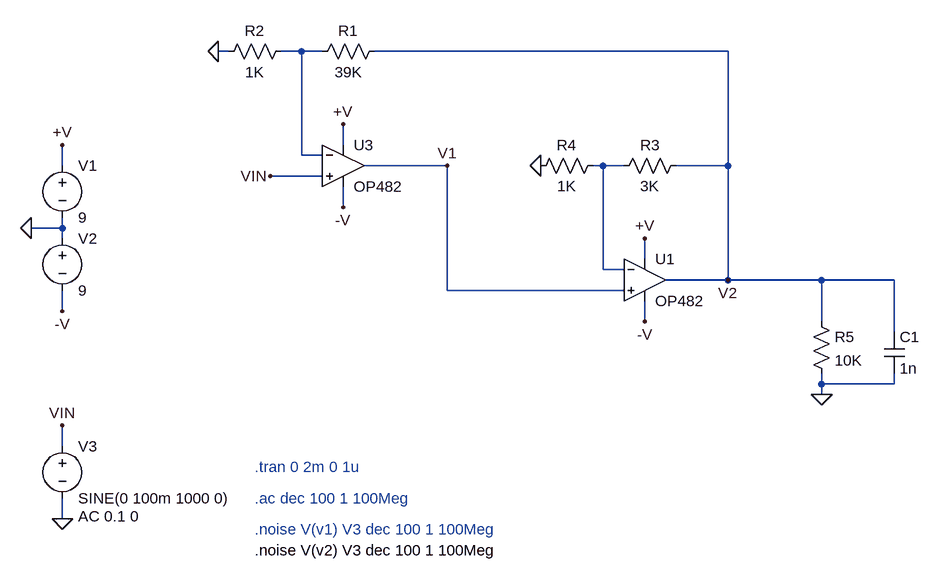
[diagram p0: schematic Draft14.asc]
Draft14.asc, the LTspice schematic file:
Version 4
SHEET 1 968 680
WIRE -112 -128 -128 -128
WIRE 0 -128 -32 -128
WIRE 32 -128 0 -128
WIRE 656 -128 112 -128
WIRE 64 16 64 -16
WIRE 0 32 0 -128
WIRE 32 32 0 32
WIRE -368 48 -368 16
WIRE 224 48 96 48
WIRE 464 48 448 48
WIRE 496 48 464 48
WIRE 656 48 656 -128
WIRE 656 48 576 48
WIRE 32 64 -48 64
WIRE 64 112 64 80
WIRE -368 144 -368 128
WIRE -368 144 -416 144
WIRE -368 160 -368 144
WIRE 528 192 528 160
WIRE 464 208 464 48
WIRE 496 208 464 208
WIRE 656 224 656 48
WIRE 656 224 560 224
WIRE 800 224 656 224
WIRE 912 224 800 224
WIRE 224 240 224 48
WIRE 496 240 224 240
WIRE -368 272 -368 240
WIRE 528 288 528 256
WIRE 800 288 800 224
WIRE 912 304 912 224
WIRE 800 384 800 368
WIRE 912 384 912 368
WIRE 912 384 800 384
WIRE 800 400 800 384
WIRE -368 480 -368 448
WIRE -368 592 -368 560
FLAG -416 144 0
FLAG -368 16 +V
FLAG -368 272 -V
FLAG 64 112 -V
FLAG 528 288 -V
FLAG 64 -16 +V
FLAG 528 160 +V
FLAG -368 592 0
FLAG -368 448 VIN
FLAG -48 64 VIN
FLAG -128 -128 0
FLAG 224 48 V1
FLAG 656 224 V2
FLAG 368 48 0
FLAG 800 400 0
SYMBOL voltage -368 32 R0
SYMATTR InstName V1
SYMATTR Value 9
SYMBOL voltage -368 144 R0
SYMATTR InstName V2
SYMATTR Value 9
SYMBOL voltage -368 464 R0
WINDOW 123 24 124 Left 2
WINDOW 39 0 0 Left 0
SYMATTR InstName V3
SYMATTR Value SINE(0 100m 1000 0)
SYMATTR Value2 AC 0.1 0
SYMBOL res 128 -144 R90
WINDOW 0 0 56 VBottom 2
WINDOW 3 32 56 VTop 2
SYMATTR InstName R1
SYMATTR Value 39K
SYMBOL res -16 -144 R90
WINDOW 0 0 56 VBottom 2
WINDOW 3 32 56 VTop 2
SYMATTR InstName R2
SYMATTR Value 1K
SYMBOL res 592 32 R90
WINDOW 0 0 56 VBottom 2
WINDOW 3 32 56 VTop 2
SYMATTR InstName R3
SYMATTR Value 3K
SYMBOL res 464 32 R90
WINDOW 0 0 56 VBottom 2
WINDOW 3 32 56 VTop 2
SYMATTR InstName R4
SYMATTR Value 1K
SYMBOL res 784 272 R0
SYMATTR InstName R5
SYMATTR Value 10K
SYMBOL cap 896 304 R0
SYMATTR InstName C1
SYMATTR Value 1n
SYMBOL OpAmps\\OP482 64 -16 R0
SYMATTR InstName U3
SYMBOL OpAmps\\OP482 528 160 R0
SYMATTR InstName U1
TEXT -72 608 Left 2 ;.noise V(v1) V3 dec 100 1 100Meg
TEXT -72 640 Left 2 !.noise V(v2) V3 dec 100 1 100Meg
TEXT -72 560 Left 2 ;.ac dec 100 1 100Meg
TEXT -72 512 Left 2 ;.tran 0 2m 0 1u

The netlist it stands for:
* Draft14.asc
V1 +V 0 9
V2 0 -V 9
V3 VIN 0 SINE(0 100m 1000 0) AC 0.1 0
R1 V2 N001 39K
R2 N001 0 1K
R3 V2 N002 3K
R4 N002 0 1K
R5 V2 0 10K
C1 V2 0 1n
XU3 VIN N001 +V -V V1 OP482  ; pins In+ In- V+ V- OUT
XU1 V1 N002 +V -V V2 OP482  ; pins In+ In- V+ V- OUT
* .noise V(v1) V3 dec 100 1 100Meg
.noise V(v2) V3 dec 100 1 100Meg
* .ac dec 100 1 100Meg
* .tran 0 2m 0 1u
.backanno
.end